# EAGLE schematic mcp23s17_sample (EAGLE 8.2.1)
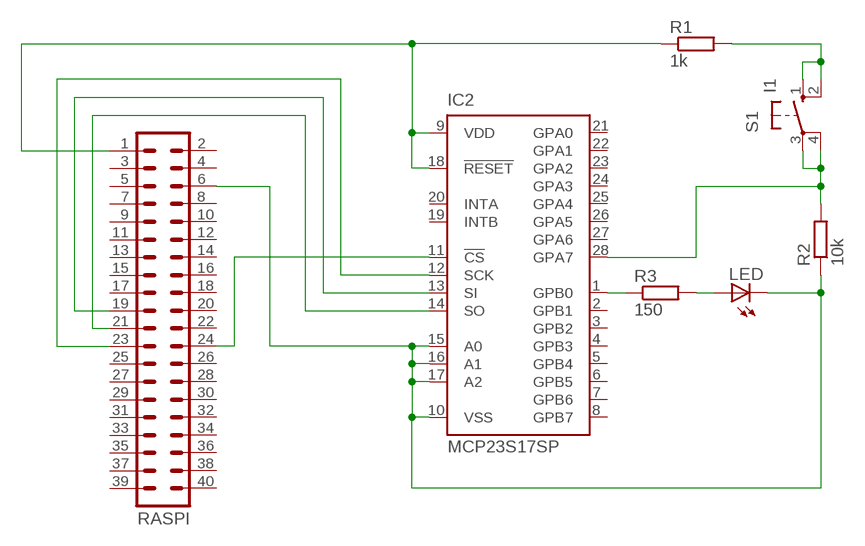
[diagram p0: schematic, sheet 1]

## Parts
IC2  MCP23S17SP  [DIL28-3]
LED  LED5MM  [LED5MM]
R1  1k  R-EU_0207/10  [0207/10]
R2  10k  R-EU_0207/10  [0207/10]
R3  150  R-EU_0207/10  [0207/10]
RASPI  ML40  [ML40]
S1  I1  10-XX  [B3F-10XX]

## Nets
N$1: IC2.1(GPB0) R3.1
N$2: IC2.10(VSS) IC2.15(A0) IC2.16(A1) IC2.17(A2) LED.K(C) R2.1 RASPI.6
N$3: IC2.14(SO) RASPI.21
N$4: IC2.13(SI) RASPI.19
N$5: IC2.9(VDD) IC2.18(!RESET) R1.1 RASPI.1
N$6: LED.A R3.2
N$8: IC2.28(GPA7) R2.2 S1.3(P) S1.4(P1)
N$9: R1.2 S1.1(S) S1.2(S1)
N$22: IC2.12(SCK) RASPI.23
N$24: IC2.11(!CS) RASPI.24
Unconnected: IC2.2(GPB1) IC2.3(GPB2) IC2.4(GPB3) IC2.5(GPB4) IC2.6(GPB5) IC2.7(GPB6) IC2.8(GPB7) IC2.19(INTB) IC2.20(INTA) IC2.21(GPA0) IC2.22(GPA1) IC2.23(GPA2) IC2.24(GPA3) IC2.25(GPA4) IC2.26(GPA5) IC2.27(GPA6) RASPI.2 RASPI.3 RASPI.4 RASPI.5 RASPI.7 RASPI.8 RASPI.9 RASPI.10 RASPI.11 RASPI.12 RASPI.13 RASPI.14 RASPI.15 RASPI.16 RASPI.17 RASPI.18 RASPI.20 RASPI.22 RASPI.25 RASPI.26 RASPI.27 RASPI.28 RASPI.29 RASPI.30 RASPI.31 RASPI.32 RASPI.33 RASPI.34 RASPI.35 RASPI.36 RASPI.37 RASPI.38 RASPI.39 RASPI.40

## Library data of the parts
IC2 = microchip:MCP23S17: http://ww1.microchip.com/downloads/en/DeviceDoc/21952a.pdf Source: http://ww1.microchip.com/downloads/en/DeviceDoc/21952a.pdf; MF: MICROCHIP; MPN: MCP23S17-E/SP; OC_FARNELL: 1292238; OC_NEWARK: 31K2951
LED = led:LED: LED OSRAM: - CHIPLED LG R971, LG N971, LY N971, LG Q971, LY Q971, LO R971, LY R971 LH N974, LH R974 LS Q976, LO Q976, LY Q976 LO Q996 - Hyper CHIPLED LW Q18S LB Q993, LB Q99A, LB R99A - SideLED LS A670, LO A670, LY A670, LG A670, LP A670 LB A673, LV A673, LT A673, LW A673 LH A674 LY A675 LS A676, LA A676, LO A676, LY A676, LW A676 LS A679, LY A679, LG A679 - Hyper Micro SIDELED® LS Y876, LA Y876, LO Y876, LY Y876 LT Y87S - SmartLED LW L88C, LW L88S LB L89C, LB L89S, LG L890 LS L89K, LO L89K, LY L89K LS L896, LA L896, LO L896, LY L896 - TOPLED LS T670, LO T670, LY T670, LG T670, LP T670 LSG T670, LSP T670, LSY T670, LOP T670, LYG T670 LG T671, LOG T671, LSG T671 LB T673, LV T673, LT T673, LW T673 LH T674 LS T676, LA T676, LO T676, LY T676, LB T676, LH T676, LSB T676, LW T676 LB T67C, LV T67C, LT T67C, LS T67K, LO T67K, LY T67K, LW E67C LS E67B, LA E67B, LO E67B, LY E67B, LB E67C, LV E67C, LT E67C LW T67C LS T679, LY T679, LG T679 LS T770, LO T770, LY T770, LG T770, LP T770 LB T773, LV T773, LT T773, LW T773 LH T774 LS E675, LA E675, LY E675, LS T675 LS T776, LA T776, LO T776, LY T776, LB T776 LHGB T686 LT T68C, LB T68C - Hyper Mini TOPLED® LB M676 - Mini TOPLED Santana® LG M470 LS M47K, LO M47K, LY M47K Source: http://www.osram.convergy.de LUXEON: - LUMILED® LXK2-PW12-R00, LXK2-PW12-S00, LXK2-PW14-U00, LXK2-PW14-V00 LXK2-PM12-R00, LXK2-PM12-S00, LXK2-PM14-U00 LXK2-PE12-Q00, LXK2-PE12-R00, LXK2-PE12-S00, LXK2-PE14-T00, LXK2-PE14-U00 LXK2-PB12-K00, LXK2-PB12-L00, LXK2-PB12-M00, LXK2-PB14-N00, LXK2-PB14-P00, LXK2-PB14-Q00 LXK2-PR12-L00, LXK2-PR12-M00, LXK2-PR14-Q00, LXK2-PR14-R00 LXK2-PD12-Q00, LXK2-PD12-R00, LXK2-PD12-S00 LXK2-PH12-R00, LXK2-PH12-S00 LXK2-PL12-P00, LXK2-PL12-Q00, LXK2-PL12-R00 Source: www.luxeon.com KINGBRIGHT: KA-3528ASYC Source: www.kingbright.com
R1-R3 = resistor:R-EU_: RESISTOR, European symbol
RASPI = con-ml:ML40: HARTING; OC_FARNELL: unknown; OC_NEWARK: unknown
S1 = switch-omron:10-XX: OMRON SWITCH; MPN: B3F-1000; OC_FARNELL: 176432; OC_NEWARK: 36M3542